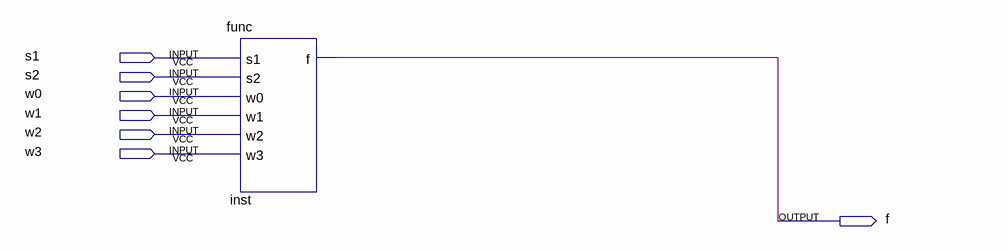
[diagram p0: schematic sheet]
// Quartus schematic func.bdf as structural Verilog: 1 symbols, 7 pins
module func (
  input  s1,
  input  s2,
  input  w0,
  input  w1,
  input  w2,
  input  w3,
  output f
);

  func inst (.s1(s1), .s2(s2), .w0(w0), .w1(w1), .w2(w2), .w3(w3), .f(f));
endmodule
